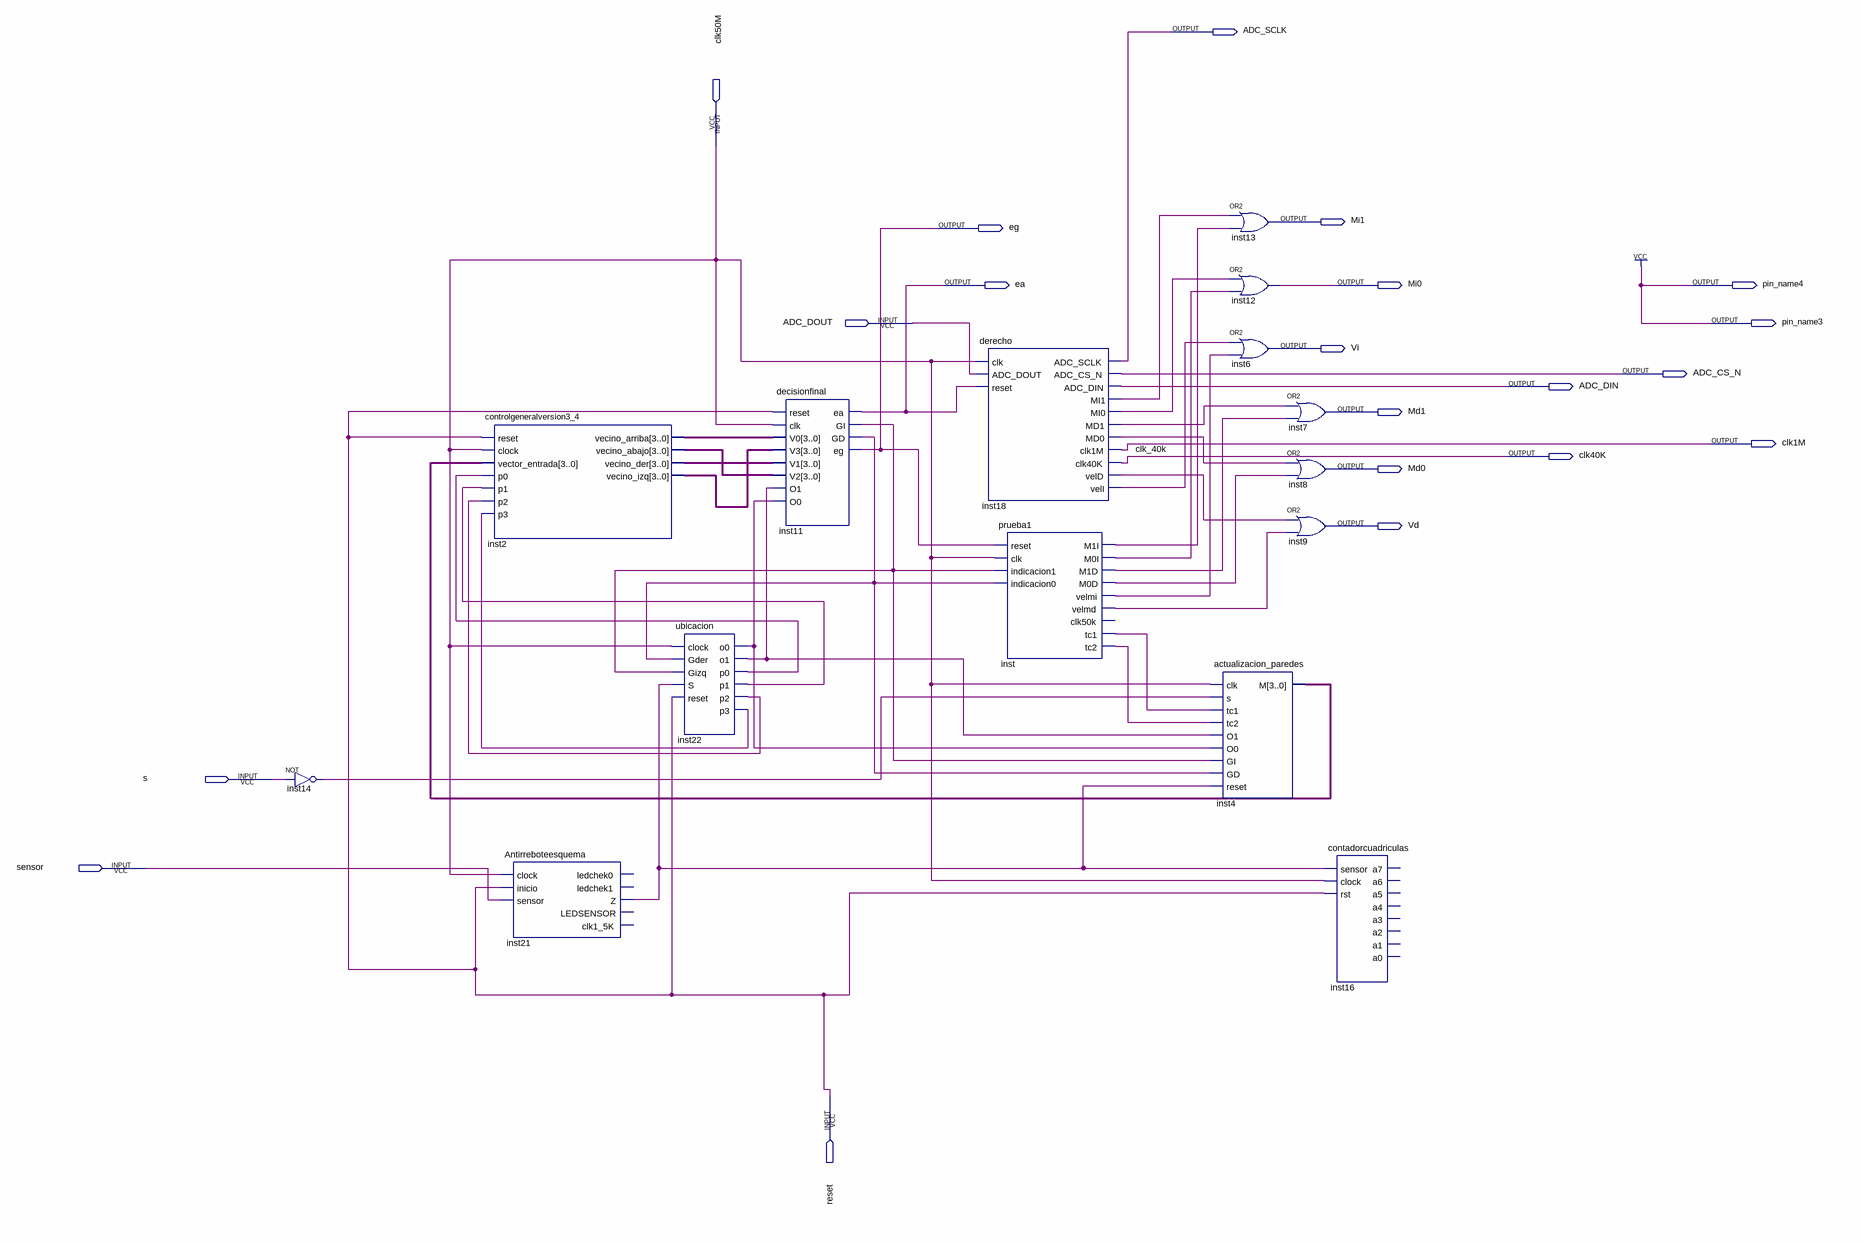
[diagram p0: schematic sheet]
// Quartus schematic fin.bdf as structural Verilog: 15 symbols, 20 pins
module fin (
  input  clk50M,
  input  ADC_DOUT,
  input  s,
  input  sensor,
  input  reset,
  output ADC_SCLK,
  output Mi1,
  output eg,
  output ea,
  output Mi0,
  output pin_name4,
  output pin_name3,
  output Vi,
  output ADC_CS_N,
  output ADC_DIN,
  output Md1,
  output clk1M,
  output clk40K,
  output Md0,
  output Vd
);

  wire inst11_gd, inst11_gi, inst14_out, inst18_md0, inst18_md1, inst18_mi0, inst18_mi1, inst18_veld,
       inst18_veli, inst21_z, inst22_o0, inst22_o1, inst22_p0, inst22_p1, inst22_p2, inst22_p3, inst_m0d,
       inst_m0i, inst_m1d, inst_m1i, inst_tc1, inst_tc2, inst_velmd, inst_velmi;
  wire [3:0] inst2_vecino_abajo, inst2_vecino_arriba, inst2_vecino_der, inst2_vecino_izq, inst4_m;

  not inst14 (inst14_out, s);
  controlgeneralversion3_4 inst2 (
    .reset(reset), .clock(clk50M), .vector_entrada(inst4_m), .p0(inst22_p0), .p1(inst22_p1), .p2(inst22_p2),
    .p3(inst22_p3), .vecino_arriba(inst2_vecino_arriba), .vecino_abajo(inst2_vecino_abajo),
    .vecino_der(inst2_vecino_der), .vecino_izq(inst2_vecino_izq));
  Antirreboteesquema inst21 (
    .clock(clk50M), .inicio(reset), .sensor(sensor), .Z(inst21_z));  // open: ledchek0, ledchek1, LEDSENSOR, clk1_5K
  ubicacion inst22 (
    .clock(clk50M), .Gder(inst11_gd), .Gizq(inst11_gi), .S(inst21_z), .reset(reset), .o0(inst22_o0),
    .o1(inst22_o1), .p0(inst22_p0), .p1(inst22_p1), .p2(inst22_p2), .p3(inst22_p3));
  decisionfinal inst11 (
    .reset(reset), .clk(clk50M), .V0(inst2_vecino_arriba), .V3(inst2_vecino_izq), .V1(inst2_vecino_der),
    .V2(inst2_vecino_abajo), .O1(inst22_o1), .O0(inst22_o0), .ea(ea), .GI(inst11_gi), .GD(inst11_gd), .eg(eg));
  derecho inst18 (
    .clk(clk50M), .ADC_DOUT(ADC_DOUT), .reset(ea), .ADC_SCLK(ADC_SCLK), .ADC_CS_N(ADC_CS_N),
    .ADC_DIN(ADC_DIN), .MI1(inst18_mi1), .MI0(inst18_mi0), .MD1(inst18_md1), .MD0(inst18_md0), .clk1M(clk1M),
    .clk40K(clk40K), .velD(inst18_veld), .velI(inst18_veli));
  prueba1 inst (
    .reset(eg), .clk(clk50M), .indicacion1(inst11_gi), .indicacion0(inst11_gd), .M1I(inst_m1i),
    .M0I(inst_m0i), .M1D(inst_m1d), .M0D(inst_m0d), .velmi(inst_velmi), .velmd(inst_velmd), .tc1(inst_tc1),
    .tc2(inst_tc2));  // open: clk50k
  or inst13 (Mi1, inst18_mi1, inst_m1i);
  or inst12 (Mi0, inst18_mi0, inst_m0i);
  or inst6 (Vi, inst18_veli, inst_velmi);
  actualizacion_paredes inst4 (
    .clk(clk50M), .s(inst14_out), .tc1(inst_tc1), .tc2(inst_tc2), .O1(inst22_o1), .O0(inst22_o0),
    .GI(inst11_gi), .GD(inst11_gd), .reset(inst21_z), .M(inst4_m));
  or inst7 (Md1, inst18_md1, inst_m1d);
  or inst8 (Md0, inst18_md0, inst_m0d);
  or inst9 (Vd, inst18_veld, inst_velmd);
  contadorcuadriculas inst16 (.sensor(inst21_z), .clock(clk50M), .rst(reset));  // open: a7, a6, a5, a4, a3, a2, a1, a0

  assign pin_name3 = 1'b1;
  assign pin_name4 = 1'b1;

  // Other names for the same wires on the sheet: clk_40k = clk40K
endmodule
